# Altium schematic sheet Schematic_SensorTapeFlex_v1.SchDoc: SensorTape Flex PCB
size B; Author: Artem Dementyev; Address1: MIT Media Lab; Address2: Responsive Environments; Address3: Artem Dementyev; DocumentNumber: 1; Revision: 1.0; SheetNumber: 1; SheetTotal: 1
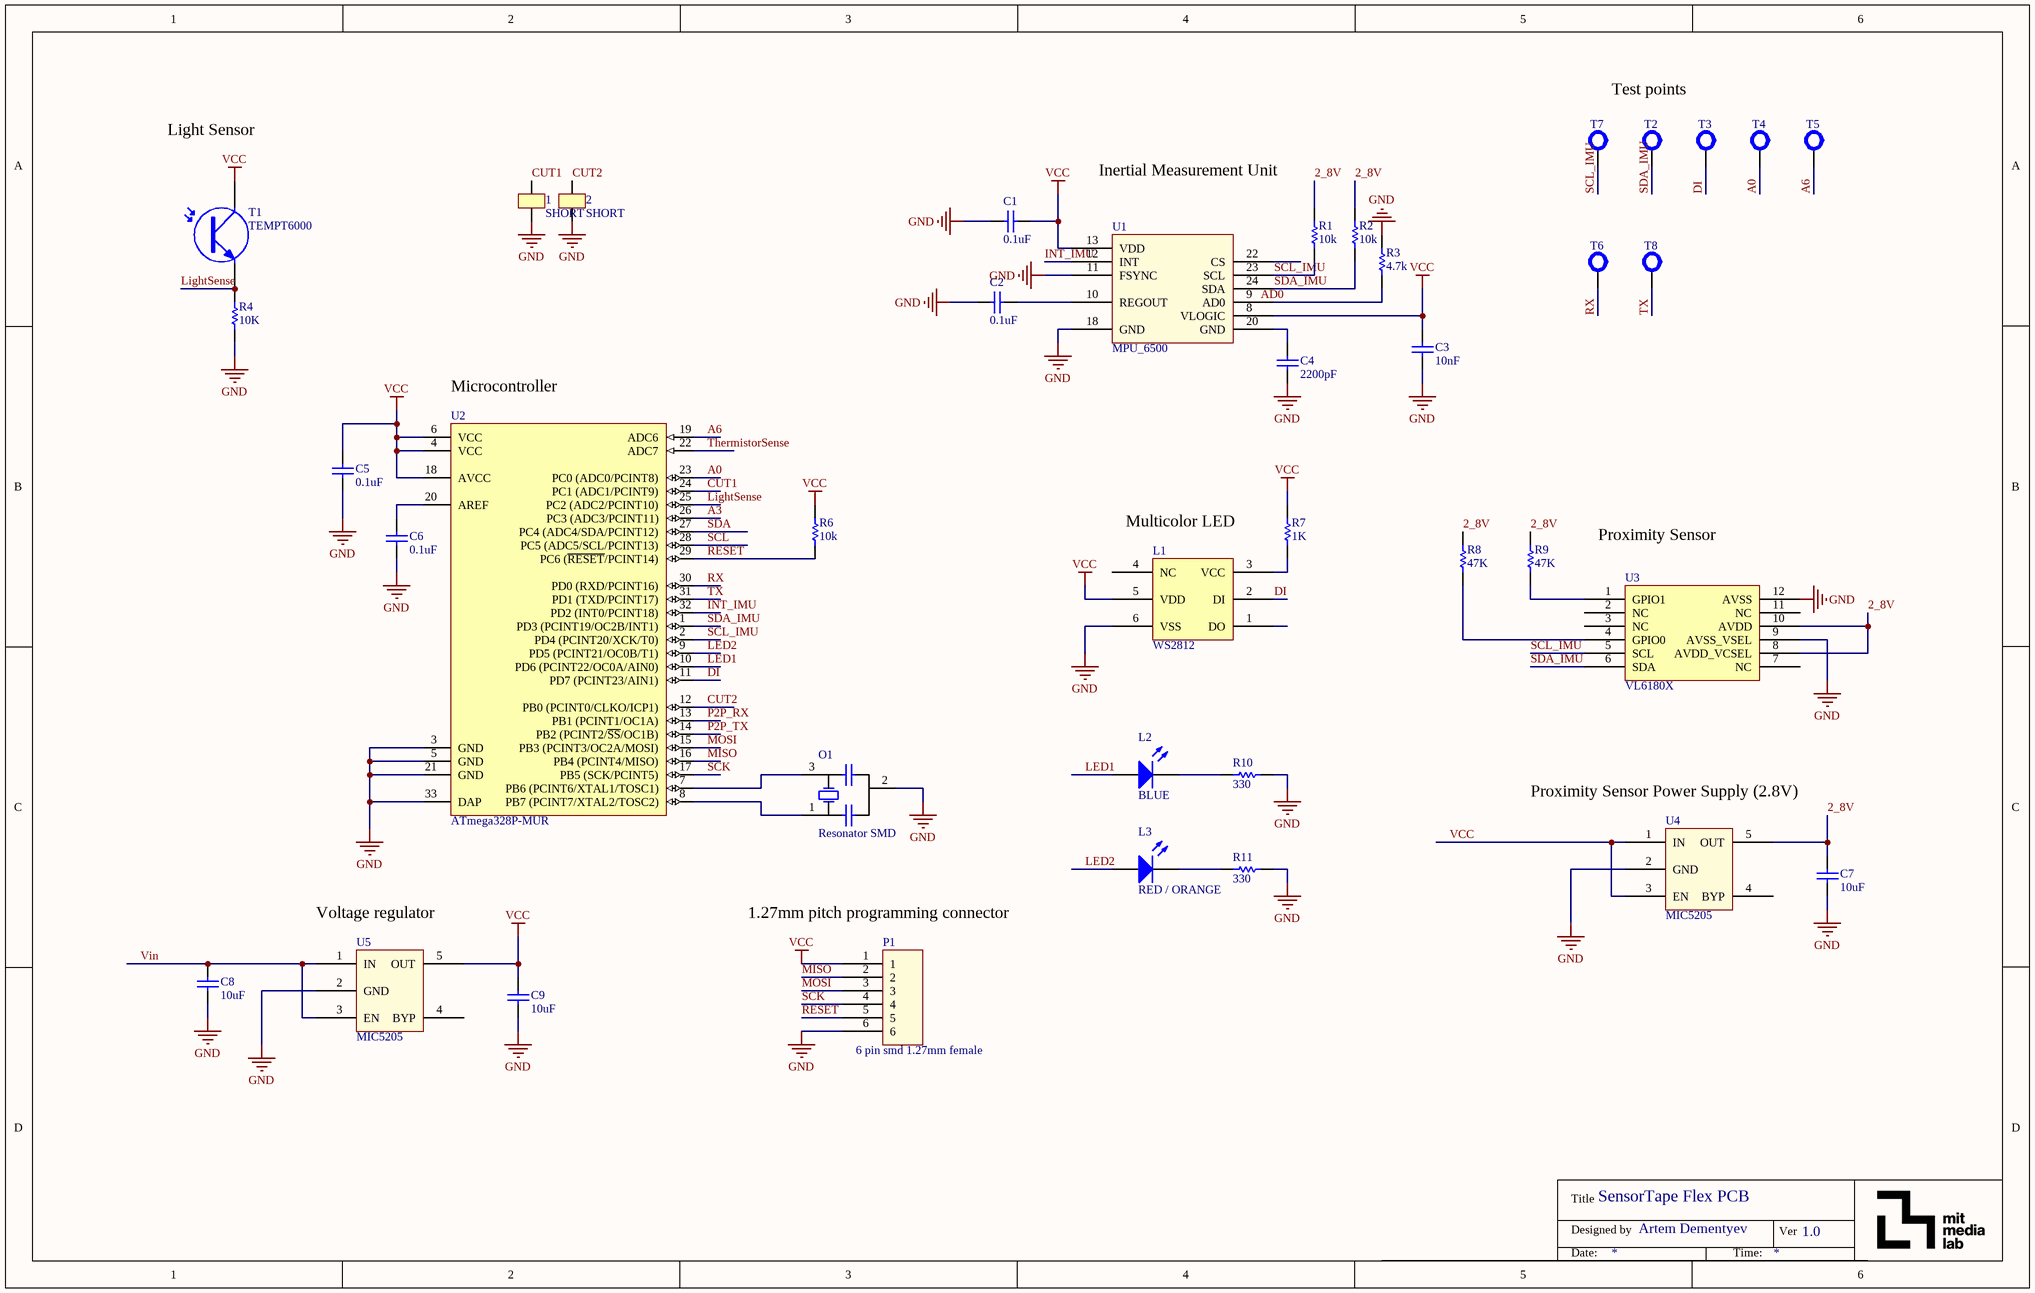
[diagram p0: Schematic_SensorTapeFlex_v1.SchDoc]

## Parts
1  SHORT  [SHORT]
2  SHORT  [SHORT]
C1  0.1uF  [0603W]
C2  0.1uF  [0603W]
C3  10nF  [0603W]
C4  2200pF  [0603W]
C5  0.1uF  [0603W]
C6  0.1uF  [0603W]
C7  10uF  [0603W]
C8  10uF  [0603W]
C9  10uF  [0603W]
L1  WS2812  [WS2812]
L2  BLUE  [0603W]
L3  RED / ORANGE  [0603W]
O1  Resonator SMD  [Resonator SMD]
P1  6 pin smd 1.27mm female  [6pos 1.27mm]
R1  10k  [0603W]
R2  10k  [0603W]
R3  4.7k  [0603W]
R4  10K  [0603W]
R6  10k  [0603W]
R7  1K  [0603W]
R8  47K  [0603W]
R9  47K  [0603W]
R10  330  [0603W]
R11  330  [0603W]
T1  TEMPT6000  [TEMP6000]
T2  (no value)  [TEST POINT SMD SUPER SMALL]
T3  (no value)  [TEST POINT SMD SUPER SMALL]
T4  (no value)  [TEST POINT SMD SUPER SMALL]
T5  (no value)  [TEST POINT SMD SUPER SMALL]
T6  (no value)  [TEST POINT SMD SUPER SMALL]
T7  (no value)  [TEST POINT SMD SUPER SMALL]
T8  (no value)  [TEST POINT SMD SUPER SMALL]
U1  MPU_6500  [QFN24]
U2  ATmega328P-MUR  [32M1-A_M]
U3  VL6180X  [VL6180X]
U4  MIC5205  [SOT-23-5]
U5  MIC5205  [SOT-23-5]

## Nets
GND: 1.0 2.0 C1.2 C2.2 C3.2 C4.2 C5.1 C6.1 C7.1 C8.1 C9.1 L1.6(VSS) O1.2 P1.6 R3.2 R4.1 R10.1 R11.1 U1.11(FSYNC) U1.18(GND) U2.3(GND) U2.5(GND) U2.21(GND) U2.33(DAP) U3.9(AVSS_VSEL) U3.12(AVSS) U4.2(GND) U5.2(GND)
VCC: C1.1 C3.1 C5.2 C9.2 L1.5(VDD) P1.1 R6.2 R7.2 T1.1(C) U1.8(VLOGIC) U1.13(VDD) U2.4(VCC) U2.6(VCC) U2.18(AVCC) U4.1(IN) U4.3(EN) U5.5(OUT)
2_8V: C7.2 R1.2 R2.2 R8.2 R9.2 U3.8(AVDD_VCSEL) U3.10(AVDD) U4.5(OUT)
A0: T4.0 U2.23(PC0_(ADC0/PCINT8))
A3: U2.26(PC3_(ADC3/PCINT11))
A6: T5.0 U2.19(ADC6)
CUT1: 1.1 U2.24(PC1_(ADC1/PCINT9))
CUT2: 2.1 U2.12(PB0_(PCINT0/CLKO/ICP1))
DI: L1.2(DI) T3.0 U2.11(PD7_(PCINT23/AIN1))
INT_IMU: U1.12(INT) U2.32(PD2_(INT0/PCINT18))
LED1: L2.1(A) U2.10(PD6_(PCINT22/OC0A/AIN0))
LED2: L3.1(A) U2.9(PD5_(PCINT21/OC0B/T1))
LightSense: R4.2 T1.2(E) U2.25(PC2_(ADC2/PCINT10))
MISO: P1.2 U2.16(PB4_(PCINT4/MISO))
MOSI: P1.3 U2.15(PB3_(PCINT3/OC2A/MOSI))
P2P_RX: U2.13(PB1_(PCINT1/OC1A))
P2P_TX: U2.14(PB2_(PCINT2/~{SS}/OC1B))
RESET: P1.5 R6.1 U2.29(PC6_(~{RESET}/PCINT14))
RX: T6.0 U2.30(PD0_(RXD/PCINT16))
SCK: P1.4 U2.17(PB5_(SCK/PCINT5))
SCL: U2.28(PC5_(ADC5/SCL/PCINT13))
SCL_IMU: R1.1 T7.0 U1.23(SCL) U2.2(PD4_(PCINT20/XCK/T0)) U3.5(SCL)
SDA: U2.27(PC4_(ADC4/SDA/PCINT12))
SDA_IMU: R2.1 T2.0 U1.24(SDA) U2.1(PD3_(PCINT19/OC2B/INT1)) U3.6(SDA)
ThermistorSense: U2.22(ADC7)
TX: T8.0 U2.31(PD1_(TXD/PCINT17))
Vin: C8.2 U5.1(IN) U5.3(EN)
NetC2_1: C2.1 U1.10(REGOUT)
NetC4_1: C4.1 U1.20(GND)
NetC6_2: C6.2 U2.20(AREF)
NetL1_3: L1.3(VCC) R7.1
NetL2_2: L2.2(K) R10.2
NetL3_2: L3.2(K) R11.2
NetO1_1: O1.1 U2.8(PB7_(PCINT7/XTAL2/TOSC2))
NetO1_3: O1.3 U2.7(PB6_(PCINT6/XTAL1/TOSC1))
NetR3_1: R3.1 U1.9(AD0)
NetR8_1: R8.1 U3.4(GPIO0)
NetR9_1: R9.1 U3.1(GPIO1)

Not connected (* = marked no-connect by the designer): L1 1(DO) 4(NC); U1 22(CS); U3 2(NC) 3(NC) 7(NC) 11(NC); U4 4(BYP); U5 4(BYP)

## Notes on the sheet
- Test points
- Light Sensor
- Inertial Measurement Unit
- (near U2) Microcontroller
- (near U2) A6
- (near U2) A0
- (near U2) A1
- (near U2) A2
- (near U2) A7
- (near U2) A4
- (near U2) A5
- (near U2) A3
- Multicolor LED
- Proximity Sensor
- (near U2) D3
- (near U2) D4
- (near U2) RXI
- (near U2) TXI
- (near U2) D2
- (near U2) D6
- (near U2) D5
- (near U2) D7
- (near U2) D8
- (near U2) D10
- (near U2) D9
- (near U4) Proximity Sensor Power Supply (2.8V)
- (near U5) Voltage regulator
- (near P1) 1.27mm pitch programming connector
- Labels drawn without touching a wire or pin: AD0
- Title
- Designed by
- Ver
- Date:
- Time:

## Library data of the parts
C1-C9 = Capacitor: SMD Cap 1206
  C1-C4 C7-C9: digikey number: 587-3383-1-ND
  C5 C6: digikey number: 490-1532-1-ND
L1 = WS2812: adafruit: 1379
L2 L3 = LED: LED SMD 1206/0603; Sparkfun green: PRT-12622; Sparkfun blue: PRT-12620
  L2: digikey number: 160-1647-1-ND
  L3: digikey number: 160-1447-1-ND
O1 = Resonator SMD: Build in caps; digikey number: 490-1195-1-ND
R1-R4 R6-R11 = Resistor
  R1-R4 R6 R7: digikey number: RMCF0603FT10K0CT-ND
  R10 R11: digikey number: RHM330DCT-ND
T1 = TEMPT6000: Sparkfun: BOB-08688; digikey number: 751-1055-1-ND
T2-T8 = Test point small
U1 = MPU_6500: Gyro / accelerometer combo
U2 = ATmega328P-MUR: 8-bit AVR Microcontroller, 32KB Flash, 1KB EEPROM, 2KB SRAM, 32-pin MLF, Industrial Grade (-40°C to 85°C); digikey number: ATMEGA328P-MURCT-ND
U4 = MIC5205_VOLTAGE_REG: 2.8V LDO SMD; Sparkfun #: PRT-1125; digikey number: 576-1259-1-ND
U5 = MIC5205_VOLTAGE_REG: 3.3V LDO SMD; Sparkfun #: PRT-1125; digikey number: 576-1259-1-ND
P1 = 6 pin smd 1.27mm female: digikey number: ED90490-ND
U3 = VL6180X: digikey number: *